# Altium schematic sheet Cell.SchDoc
size A; SheetNumber: 5
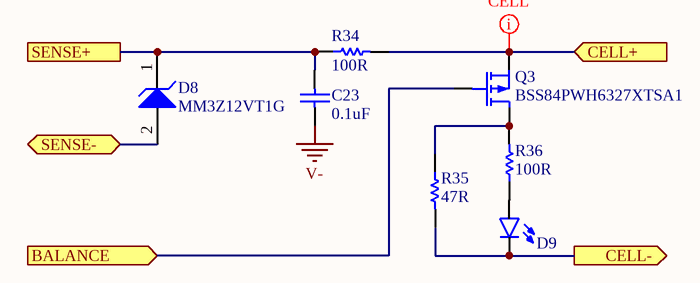
[diagram p0: Cell.SchDoc]

## Parts
C23  value 0.1uF  [C0603[1608X92]]  (hidden comment: 0.1uF 100V 0603)
D8  MM3Z12VT1G  [SOD-323]
D9  LED_0603_BLUE_5mA  [LED0603]  (value not drawn)
Q3  BSS84PWH6327XTSA1  [SOT323-3]
R34  value 100R  [R0603[1608]]  (hidden comment: 100R 1% 0603)
R35  value 47R  [R0805[2012]]  (hidden comment: 47R 5% 0805)
R36  value 100R  [R0603[1608]]  (hidden comment: 100R 1% 0603)

## Ports
BALANCE (in), CELL+ (in), CELL- (out), SENSE+, SENSE- (bidir)

## Nets
V-: C23.1
BALANCE: Q3.1(G) ; port BALANCE
CELL+: Q3.2(S) R34.1 ; port CELL+
CELL-: D9.C R35.1 ; port CELL-
SENSE+: C23.2 D8.1(K) R34.2 ; port SENSE+
SENSE-: D8.2(A) ; port SENSE-
NetD9_A: D9.A R36.2
NetQ3_3: Q3.3(D) R35.2 R36.1

## Layout directives
net class CELL: CELL+

## Library data of the parts
C23 = CAP_0.1uF_100V_0603_10%: 0.1uF 100V 10% 0603 (1608 Metric); PartNumber: GRM188R72A104KA35D; Manufacturer: Murata; TemperatureCoefficient: X7R; Mounting Technology: Surface Mount; PackageReference: 0603; PackageDescription: 0603 (1608 Metric); Voltage: 100V; Tolerance: 10%
D8 = MM3Z12VT1G: Zener Voltage Regulator, 300 mW, 2-Pin SOD-323, Tape and Reel; Manufacturer: ON Semiconductor; Mounting Technology: Surface Mount; PackageDescription: SOD, 2-Leads; PartNumber: MM3Z12VT1G; PackageReference: SOD-323
D9 = LED_0603_BLUE_5mA: PartNumber: LTST-C193TBKT-5A; Manufacturer: Lite-On Inc.; PackageReference: 0603; PackageDescription: 0603 (1608 Metric); Mounting Technology: Surface Mount
Q3 = BSS84PW H6327: P-Channel MOSFET; Manufacturer: Infineon; Mounting Technology: Surface Mount; PartNumber: BSS84PWH6327XTSA1; PackageReference: SOT323-3
R34 R36 = RES_100R_0603_1%: 100R 0.25W 1% 0603 (1005 Metric); Manufacturer: Vishay / Dale; PartNumber: CRCW0603100RFKEAHP; Tolerance: 1%; Power: 0.25W; Mounting Technology: Surface Mount; PackageReference: 0603; PackageDescription: 0603 (1608 Metric); ComponentLink1Description: Datasheet; ComponentLink1URL: http://www.vishay.com/docs/20043/crcwhpe3.pdf
R35 = RES_47R_0805_5%: 47R 0.5W 5% 0805 (2012 Metric); Manufacturer: Panasonic; PartNumber: ERJ-P06J470V; Tolerance: 5%; Power: 0.5W; Mounting Technology: Surface Mount; PackageReference: 0805; PackageDescription: 0805 (2012 Metric); ComponentLink1Description: Datasheet; ComponentLink1URL: https://industrial.panasonic.com/cdbs/www-data/pdf/RDA0000/AOA0000C243.pdf